# EAGLE schematic LEDASKETCH (EAGLE 6.1)
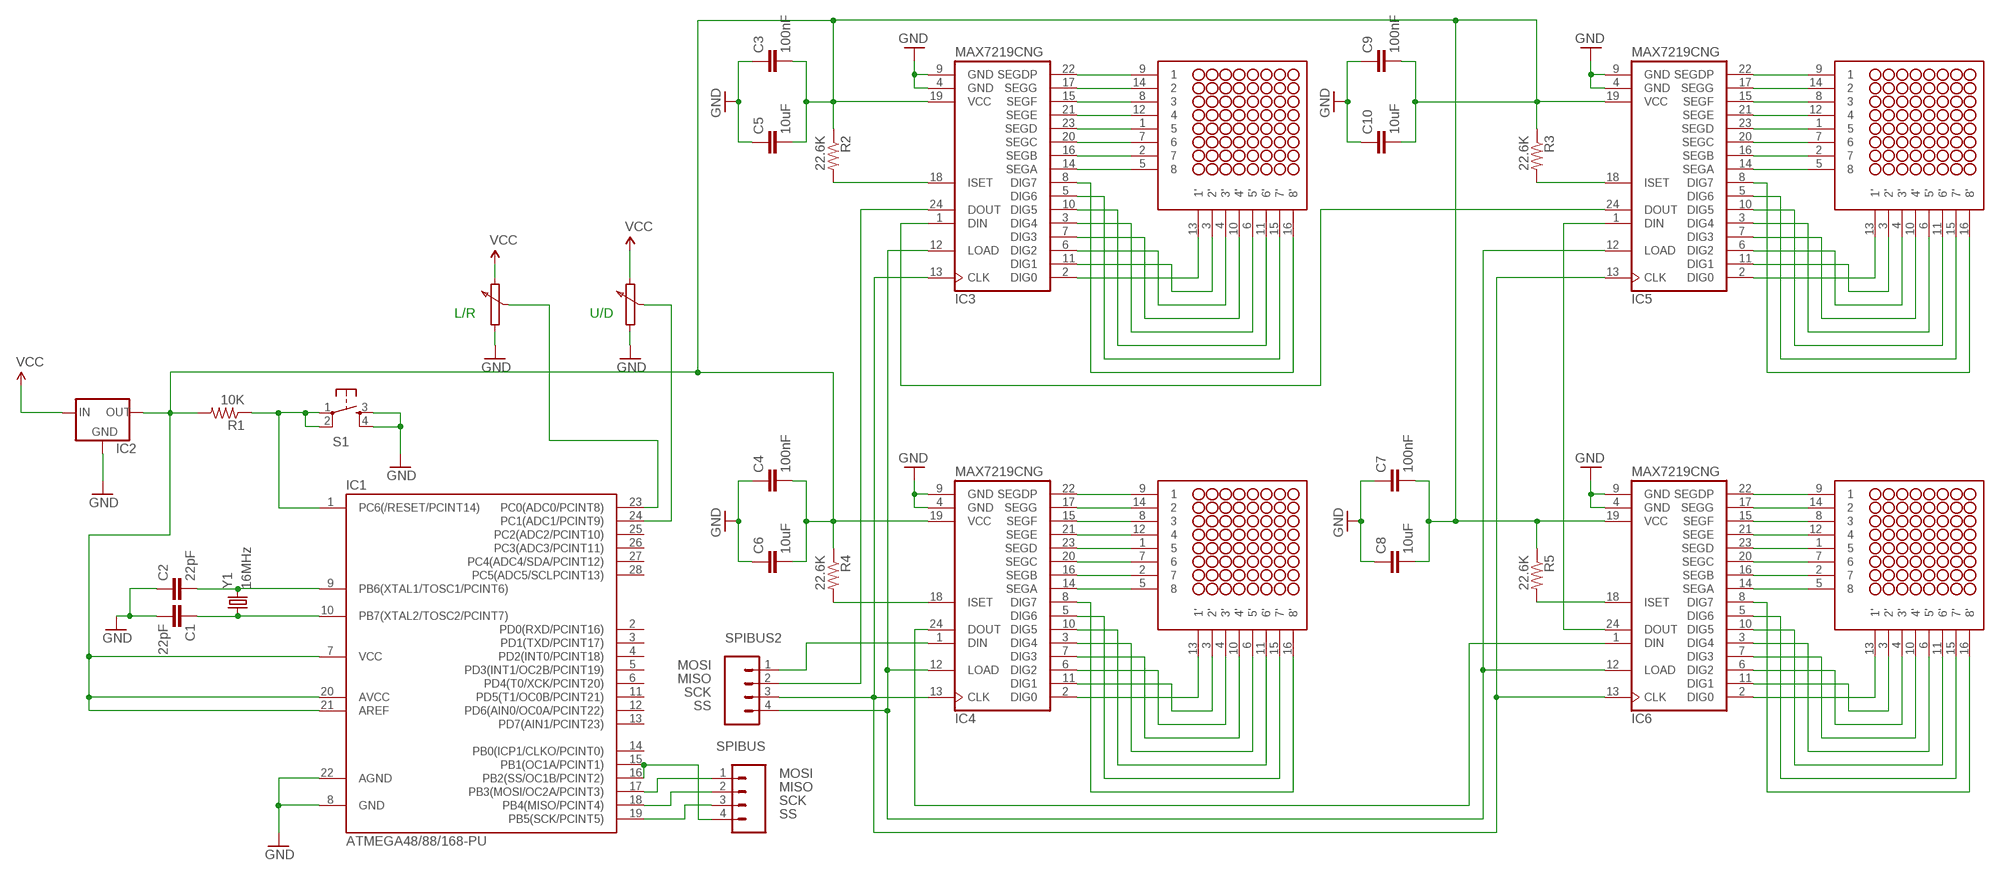
[diagram p0: schematic, sheet 1]

## Parts
C1  22pF  CAPPTH2  [CAP-PTH-SMALL2]
C2  22pF  CAPPTH2  [CAP-PTH-SMALL2]
C3  100nF  CAPPTH2  [CAP-PTH-SMALL2]
C4  100nF  CAPPTH2  [CAP-PTH-SMALL2]
C5  10uF  CAPPTH2  [CAP-PTH-SMALL2]
C6  10uF  CAPPTH2  [CAP-PTH-SMALL2]
C7  100nF  CAPPTH2  [CAP-PTH-SMALL2]
C8  10uF  CAPPTH2  [CAP-PTH-SMALL2]
C9  100nF  CAPPTH2  [CAP-PTH-SMALL2]
C10  10uF  CAPPTH2  [CAP-PTH-SMALL2]
IC1  ATMEGA48/88/168-PU  [DIL28-3]
IC2  V_REG_78XXSIDE  [78XXL]
IC3  MAX7219CNG  [DIL24-3]
IC4  MAX7219CNG  [DIL24-3]
IC5  MAX7219CNG  [DIL24-3]
IC6  MAX7219CNG  [DIL24-3]
R1  10K  RESISTORPTH-1/2W  [AXIAL-0.5]
R2  22.6K  RESISTORPTH-1/2W  [AXIAL-0.5]
R3  22.6K  RESISTORPTH-1/2W  [AXIAL-0.5]
R4  22.6K  RESISTORPTH-1/2W  [AXIAL-0.5]
R5  22.6K  RESISTORPTH-1/2W  [AXIAL-0.5]
S1  TAC_SWITCHPTH  [TACTILE-PTH]
SPIBUS  M04  [04P]
SPIBUS2  M04  [04P]
U$1  NFM-12881BG-11  [NFM-12881BG-11]
U$2  NFM-12881BG-11  [NFM-12881BG-11]
U$3  NFM-12881BG-11  [NFM-12881BG-11]
U$4  NFM-12881BG-11  [NFM-12881BG-11]
Y1  16MHz  CRYSTALHC49US  [HC49US]

## Nets
GND: C1.2 C2.1 C3.1 C4.1 C5.1 C6.1 C7.1 C8.1 C9.1 C10.1 IC1.8(GND) IC1.22(AGND) IC2.GND IC3.4(GND) IC3.9(GND) IC4.4(GND) IC4.9(GND) IC5.4(GND) IC5.9(GND) IC6.4(GND) IC6.9(GND) S1.3 S1.4
MISO: IC1.18(PB4(MISO/PCINT4)) SPIBUS.2
MOSI: IC1.17(PB3(MOSI/OC2A/PCINT3)) SPIBUS.1
N$1: IC3.13(CLK) IC4.13(CLK) IC5.13(CLK) IC6.13(CLK) SPIBUS2.3
N$2: IC1.1(PC6(/RESET/PCINT14)) R1.P$1 S1.1 S1.2
N$3: C2.2 IC1.9(PB6(XTAL1/TOSC1/PCINT6)) Y1.2
N$4: C1.1 IC1.10(PB7(XTAL2/TOSC2/PCINT7)) Y1.1
N$5: IC3.14(SEGA) U$3.5
N$6: IC3.16(SEGB) U$3.2
N$7: IC3.20(SEGC) U$3.7
N$8: IC3.23(SEGD) U$3.1
N$9: IC3.21(SEGE) U$3.12
N$10: IC3.15(SEGF) U$3.8
N$11: IC3.17(SEGG) U$3.14
N$12: IC3.22(SEGDP) U$3.9
N$13: IC3.8(DIG7) U$3.16(8')
N$14: IC3.5(DIG6) U$3.15(7')
N$15: IC3.10(DIG5) U$3.11(6')
N$16: IC3.3(DIG4) U$3.6(5')
N$17: IC3.7(DIG3) U$3.10(4')
N$18: IC3.6(DIG2) U$3.4(3')
N$19: IC3.11(DIG1) U$3.3(2')
N$20: IC3.2(DIG0) U$3.13(1')
N$21: IC4.1(DIN) SPIBUS2.1
N$22: IC3.12(LOAD) IC4.12(LOAD) IC5.12(LOAD) IC6.12(LOAD) SPIBUS2.4
N$23: IC3.18(ISET) R2.P$2
N$24: IC4.14(SEGA) U$1.5
N$25: IC4.16(SEGB) U$1.2
N$26: IC4.20(SEGC) U$1.7
N$27: IC4.23(SEGD) U$1.1
N$28: IC4.21(SEGE) U$1.12
N$29: IC4.15(SEGF) U$1.8
N$30: IC4.17(SEGG) U$1.14
N$31: IC4.22(SEGDP) U$1.9
N$32: IC4.8(DIG7) U$1.16(8')
N$33: IC4.5(DIG6) U$1.15(7')
N$34: IC4.10(DIG5) U$1.11(6')
N$35: IC4.3(DIG4) U$1.6(5')
N$36: IC4.7(DIG3) U$1.10(4')
N$37: IC4.6(DIG2) U$1.4(3')
N$38: IC4.11(DIG1) U$1.3(2')
N$39: IC4.2(DIG0) U$1.13(1')
N$40: IC5.18(ISET) R3.P$2
N$41: IC4.18(ISET) R4.P$2
N$42: IC6.18(ISET) R5.P$2
N$43: IC5.14(SEGA) U$2.5
N$44: IC5.16(SEGB) U$2.2
N$45: IC5.20(SEGC) U$2.7
N$46: IC5.23(SEGD) U$2.1
N$47: IC5.21(SEGE) U$2.12
N$48: IC5.15(SEGF) U$2.8
N$49: IC5.17(SEGG) U$2.14
N$50: IC5.22(SEGDP) U$2.9
N$51: IC5.8(DIG7) U$2.16(8')
N$52: IC5.5(DIG6) U$2.15(7')
N$53: IC5.10(DIG5) U$2.11(6')
N$54: IC5.3(DIG4) U$2.6(5')
N$55: IC5.7(DIG3) U$2.10(4')
N$56: IC5.6(DIG2) U$2.4(3')
N$57: IC5.11(DIG1) U$2.3(2')
N$58: IC5.2(DIG0) U$2.13(1')
N$59: IC3.24(DOUT) SPIBUS2.2
N$60: IC3.1(DIN) IC5.24(DOUT)
N$61: IC4.24(DOUT) IC6.1(DIN)
N$62: IC6.14(SEGA) U$4.5
N$63: IC6.16(SEGB) U$4.2
N$64: IC6.20(SEGC) U$4.7
N$65: IC6.23(SEGD) U$4.1
N$66: IC6.21(SEGE) U$4.12
N$67: IC6.15(SEGF) U$4.8
N$68: IC6.17(SEGG) U$4.14
N$69: IC6.22(SEGDP) U$4.9
N$70: IC6.8(DIG7) U$4.16(8')
N$71: IC6.5(DIG6) U$4.15(7')
N$72: IC6.10(DIG5) U$4.11(6')
N$73: IC6.3(DIG4) U$4.6(5')
N$74: IC6.7(DIG3) U$4.10(4')
N$75: IC6.6(DIG2) U$4.4(3')
N$76: IC6.11(DIG1) U$4.3(2')
N$77: IC6.2(DIG0) U$4.13(1')
N$78: C3.2 C5.2 C7.2 C8.2 C9.2 C10.2 IC1.7(VCC) IC1.20(AVCC) IC1.21(AREF) IC2.OUT IC3.19(VCC) IC4.19(VCC) IC5.19(VCC) IC6.19(VCC) R1.P$2 R2.P$1 R3.P$1 R4.P$1 R5.P$1
N$79: C4.2 C6.2
N$80: IC1.23(PC0(ADC0/PCINT8))
N$81: IC1.24(PC1(ADC1/PCINT9))
N$82: IC5.1(DIN) IC6.24(DOUT)
SCK: IC1.19(PB5(SCK/PCINT5)) SPIBUS.3
SS: IC1.15(PB1(OC1A/PCINT1)) IC1.16(PB2(SS/OC1B/PCINT2)) SPIBUS.4
VCC: IC2.IN
Unconnected: IC1.2(PD0(RXD/PCINT16)) IC1.3(PD1(TXD/PCINT17)) IC1.4(PD2(INT0/PCINT18)) IC1.5(PD3(INT1/OC2B/PCINT19)) IC1.6(PD4(T0/XCK/PCINT20)) IC1.11(PD5(T1/OC0B/PCINT21)) IC1.12(PD6(AIN0/OC0A/PCINT22)) IC1.13(PD7(AIN1/PCINT23)) IC1.14(PB0(ICP1/CLKO/PCINT0)) IC1.25(PC2(ADC2/PCINT10)) IC1.26(PC3(ADC3/PCINT11)) IC1.27(PC4(ADC4/SDA/PCINT12)) IC1.28(PC5(ADC5/SCLPCINT13))

## Notes on the sheet
- L/R | U/D

## Library data of the parts
C1-C10 = SparkFun:CAP: Capacitor Standard 0603 ceramic capacitor, and 0.1" leaded capacitor.
IC1 = atmega8:ATMEGA48/88/168-PU
IC2 = SparkFun:V_REG_78XX: Voltage Regulator Standard 7805 5V regulator. IGO (Input Ground Output). Spark Fun Electronics SKU : COM-00107
IC3-IC6 = maxim:MAX7219CNG: LED DISPLAY DRIVER; MF: MAXIM; MPN: MAX7219CNG; OC_FARNELL: 1523914; OC_NEWARK: 34C4018
R1-R5 = SparkFun:RESISTOR: Resistor Basic schematic elements and footprints for 0603, 1206, and PTH resistors.
S1 = SparkFun:TAC_SWITCH: Momentary Switch Button commonly used for reset or general input. Spark Fun Electronics SKU : COM-00097
SPIBUS SPIBUS2 = con-amp-quick:M04: AMP QUICK CONNECTOR; OC_FARNELL: unknown; OC_NEWARK: unknown
U$1-U$4 = 88Matrix:NFM-12881BG-11: Futurlec 8x8 LED Matrix
Y1 = SparkFun:CRYSTAL: Crystals Various standard crystals. Proven footprints. Spark Fun Electronics SKU : COM-00534